# EAGLE design idecf (EAGLE 7.7.0)
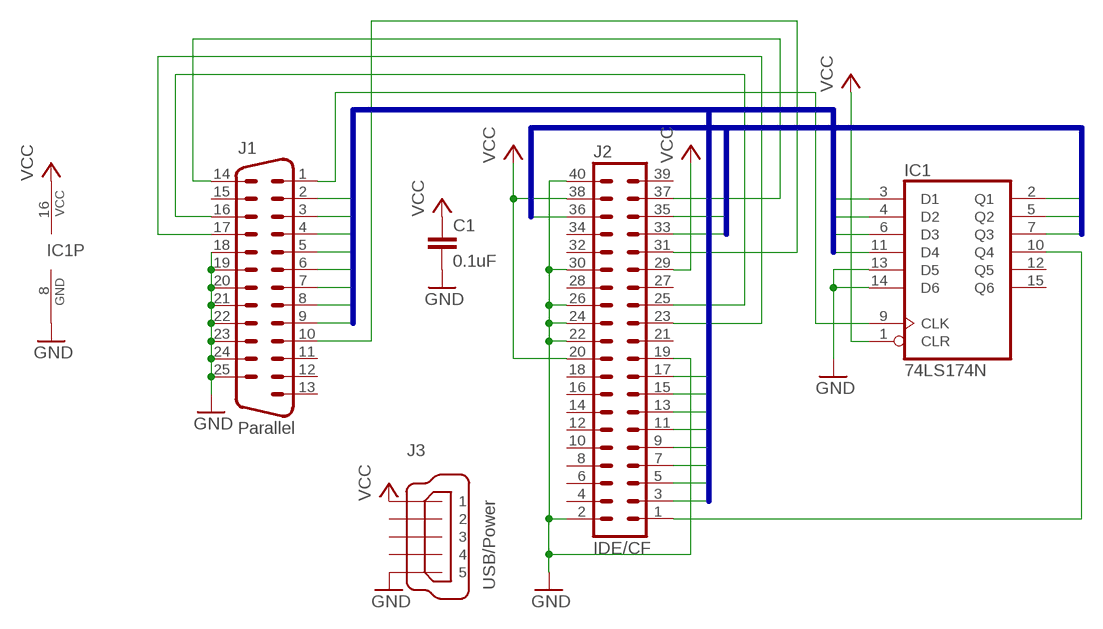
[diagram p0: schematic, sheet 1]

## Parts
C1  0.1uF  C-EU050-024X044  [C050-024X044]
IC1  74LS174N  [DIL16]
J1  Parallel  M25HP  [M25HP]
J2  IDE/CF  MA20-2W  [MA20-2W]
J3  USB/Power  MINI-USB-32005-201  [32005-201]

## Nets
!CS0: J1.14 J2.37
!RD: J1.16 J2.25
!RESET: IC1.10(Q4) J2.1
!WR: J1.17 J2.23
A0: IC1.2(Q1) J2.35
A1: IC1.5(Q2) J2.33
A2: IC1.7(Q3) J2.36
ALE: IC1.9(CLK) J1.1
D0: IC1.3(D1) J1.2 J2.17
D1: IC1.4(D2) J1.3 J2.15
D2: IC1.6(D3) J1.4 J2.13
D3: IC1.11(D4) J1.5 J2.11
D4: J1.6 J2.9
D5: J1.7 J2.7
D6: J1.8 J2.5
D7: J1.9 J2.3
GND: C1.2 IC1.8(GND) IC1.13(D5) IC1.14(D6) J1.18 J1.19 J1.20 J1.21 J1.22 J1.23 J1.24 J1.25 J2.2 J2.19 J2.22 J2.24 J2.26 J2.30 J2.40 J3.5
IRQ: J1.10 J2.31
VCC: C1.1 IC1.1(CLR) IC1.16(VCC) J2.20 J2.29 J2.38 J3.1
Unconnected: IC1.12(Q5) IC1.15(Q6) J1.11 J1.12 J1.13 J1.15 J2.4 J2.6 J2.8 J2.10 J2.12 J2.14 J2.16 J2.18 J2.21 J2.27 J2.28 J2.32 J2.34 J2.39 J3.2 J3.3 J3.4

## Buses
D[0..7]
A[0..2]

## Library data of the parts
C1 = rcl:C-EU: CAPACITOR, European symbol
IC1 = 74xx-us:74*174: Hex D type FLIP FLOP, clear
J1 = con-subd:M25: SUB-D; OC_FARNELL: unknown; OC_NEWARK: unknown
J2 = con-lstb:MA20-2W: PIN HEADER; OC_FARNELL: unknown; OC_NEWARK: unknown
J3 = con-cypressindustries:MINI-USB-: MINI USB-B Conector Source: www.cypressindustries.com; OC_FARNELL: unknown; OC_NEWARK: unknown

## Board
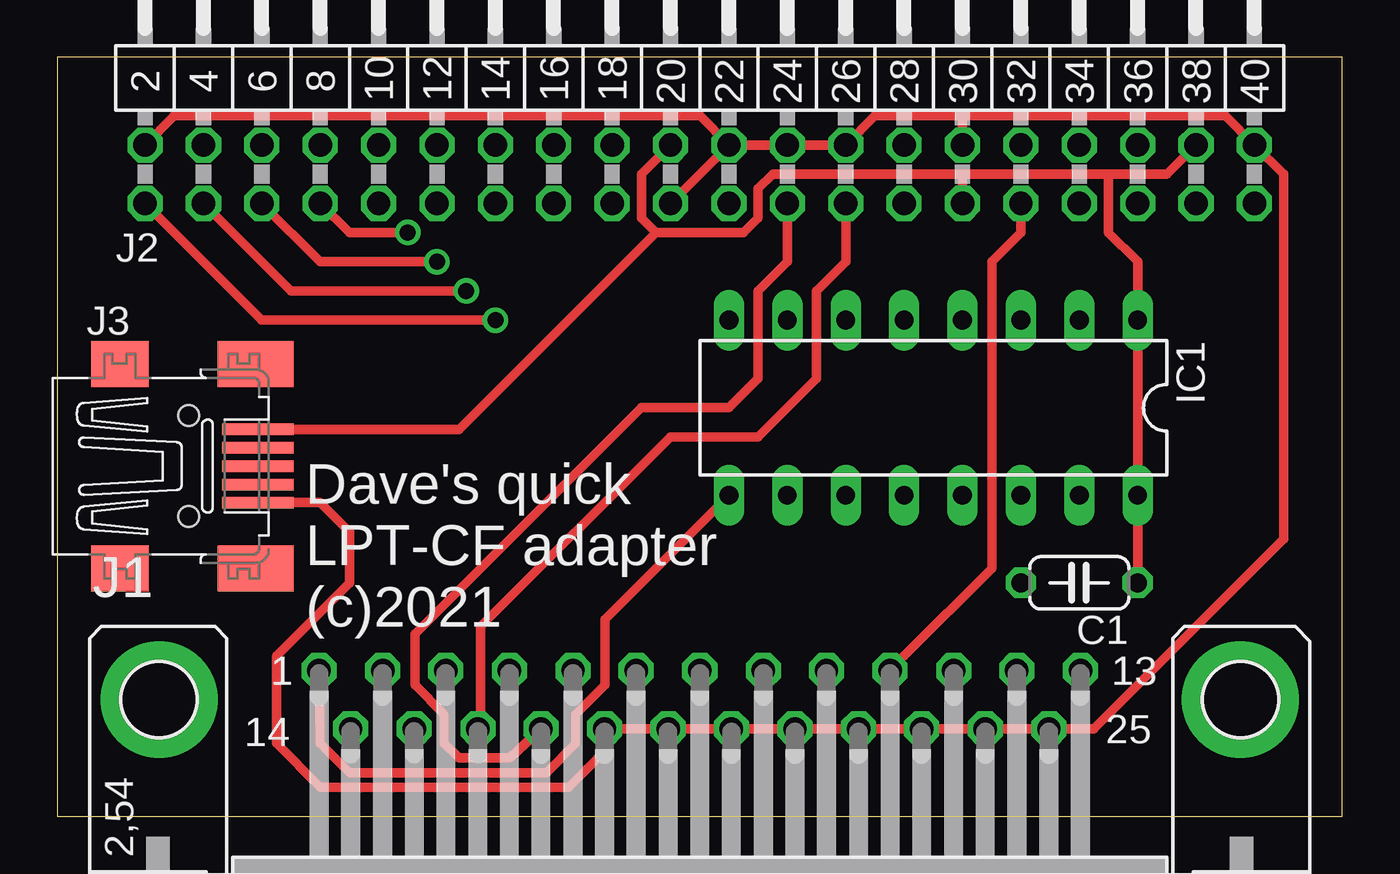
[diagram p1: board, top side]
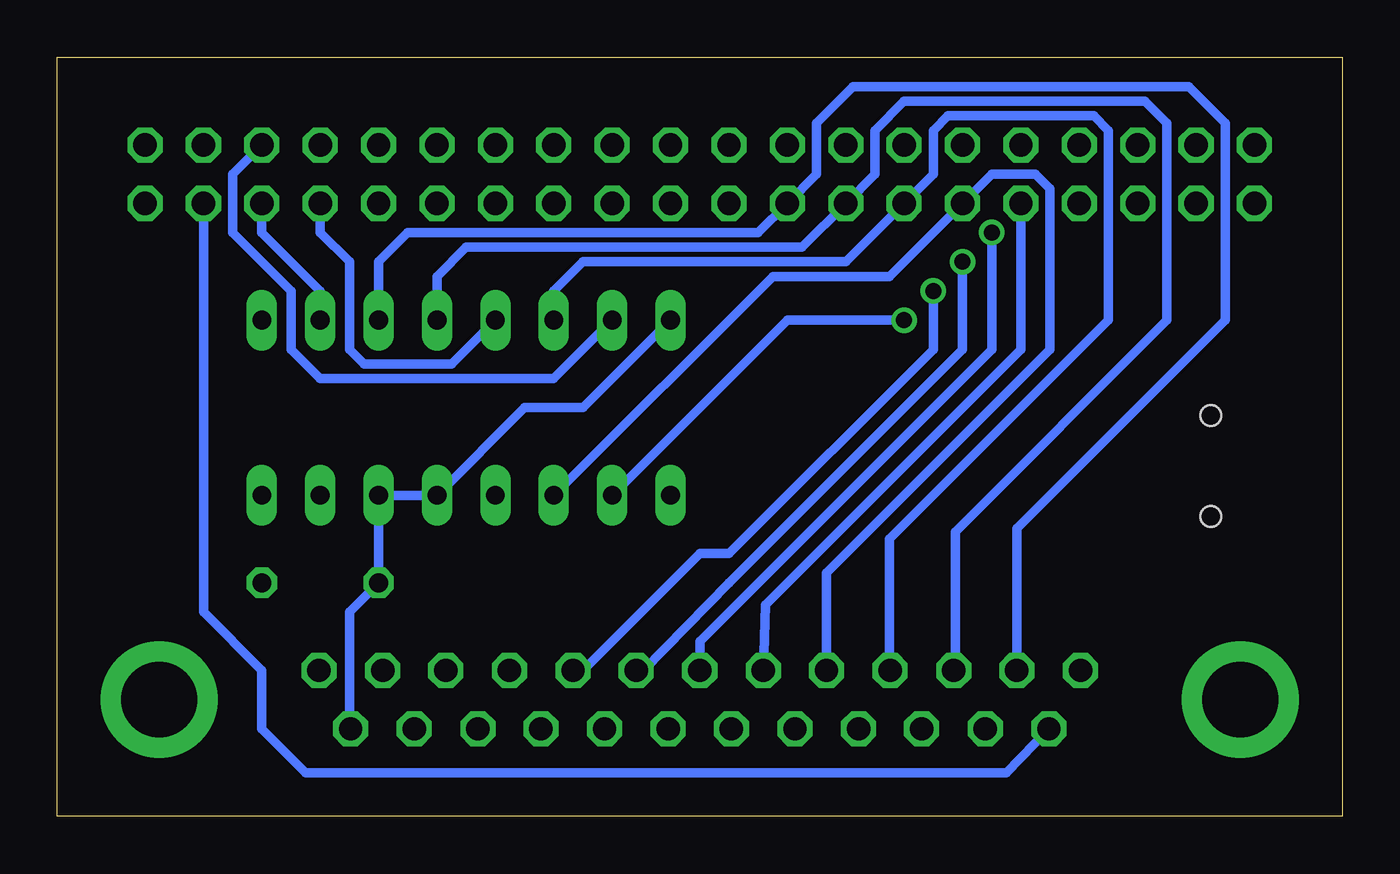
[diagram p2: board, bottom side, seen from below]

Size 55.88 x 33.02 mm. Coordinates in mm from the lower left corner, seen from the top.
Outline: 0,0 55.88,0 55.88,33.02 0,33.02 0,0
Copper layers (1*16): Top 0.035mm / dielectric 1.5mm / Bottom 0.035mm
Design rules "default": minimum track width 10mil, minimum drill 24mil, track to track 8mil, track to pad 8mil, pad to pad 8mil, via to via 8mil, smd to smd 8mil, copper to edge 40mil, drill to drill 8mil, minimum pad ring 10mil, minimum via ring 8mil, stop-mask expansion 4mil, vias tented up to drill 0mil, thermal gap 10mil

### Footprints (pad centres in the part's own frame; a part is rotated, then mirrored left to right if it is on the bottom)
C050-024X044 = drill 0.813 octagon: 1 -2.54,0; 2 2.54,0
DIL16 = drill 0.813 long: 1 -8.89,-3.81; 2 -6.35,-3.81; 3 -3.81,-3.81; 4 -1.27,-3.81; 5 1.27,-3.81; 6 3.81,-3.81; 7 6.35,-3.81; 8 8.89,-3.81; 9 8.89,3.81; 10 6.35,3.81; 11 3.81,3.81; 12 1.27,3.81; 13 -1.27,3.81; 14 -3.81,3.81; 15 -6.35,3.81; 16 -8.89,3.81
M25HP = drill 1.016 octagon: 1 -16.561,1.27; 2 -13.792,1.27; 3 -11.049,1.27; 4 -8.28,1.27; 5 -5.512,1.27; 6 -2.769,1.27; 7 0,1.27; 8 2.769,1.27; 9 5.512,1.27; 10 8.28,1.27; 11 11.049,1.27; 12 13.792,1.27; 13 16.561,1.27; 14 -15.189,-1.27; 15 -12.421,-1.27; 16 -9.652,-1.27; 17 -6.909,-1.27; 18 -4.14,-1.27; 19 -1.372,-1.27; 20 1.372,-1.27; 21 4.14,-1.27; 22 6.909,-1.27; 23 9.652,-1.27; 24 12.421,-1.27; 25 15.189,-1.27 | drill 3.302 pad 5.08: G1 -23.52,0; G2 23.52,0
MA20-2W = drill 1.016 octagon: 1 -24.13,-1.27; 2 -24.13,1.27; 3 -21.59,-1.27; 4 -21.59,1.27; 5 -19.05,-1.27; 6 -19.05,1.27; 7 -16.51,-1.27; 8 -16.51,1.27; 9 -13.97,-1.27; 10 -13.97,1.27; 11 -11.43,-1.27; 12 -11.43,1.27; 13 -8.89,-1.27; 14 -8.89,1.27; 15 -6.35,-1.27; 16 -6.35,1.27; 17 -3.81,-1.27; 18 -3.81,1.27; 19 -1.27,-1.27; 20 -1.27,1.27; 21 1.27,-1.27; 22 1.27,1.27; 23 3.81,-1.27; 24 3.81,1.27; 25 6.35,-1.27; 26 6.35,1.27; 27 8.89,-1.27; 28 8.89,1.27; 29 11.43,-1.27; 30 11.43,1.27; 31 13.97,-1.27; 32 13.97,1.27; 33 16.51,-1.27; 34 16.51,1.27; 35 19.05,-1.27; 36 19.05,1.27; 37 21.59,-1.27; 38 21.59,1.27; 39 24.13,-1.27; 40 24.13,1.27
32005-201 = smd 3.1 x 0.5: 1 3,1.6; 2 3,0.8; 3 3,0; 4 3,-0.8; 5 3,-1.6 | smd 2.5 x 2: M1 -3,-4.45; M2 -3,4.45 | smd 3.3 x 2: M3 2.9,4.45; M4 2.9,-4.45 | hole 0.9: 0,2.2; 0,-2.2

### Placement (x,y rotation side)
C1  44.45,10.16 180 top
IC1  38.1,17.78 180 top
J1  27.94,5.08 0 top
J2  27.94,27.94 0 top
J3  5.71,15.24 0 top

### Tracks (layer width: path | path; a pad name or v marks a point on that pad's centre or on a via)
!CS0
  Bottom 0.406: J2.37 49.53,8.89 46.99,6.35 46.99,3.81 45.09,1.91 14.61,1.91 J1.14
!RD
  Top 0.406: J2.25 34.29,24.13 33.02,22.86 33.02,19.05 30.48,16.51 26.67,16.51 18.41,8.26 18.41,4.13 J1.16
!RESET  (via drill 0.7)
  Top 0.406: J2.1 8.89,21.59 v19.05,21.59
  Bottom 0.406: v19.05,21.59 24.13,21.59 IC1.10
!WR
  Top 0.406: J1.17 19.68,2.54 17.46,2.54 16.83,3.17 16.83,4.45 15.56,5.71 15.56,7.94 25.4,17.78 29.21,17.78 30.48,19.05 30.48,22.86 31.75,24.13 J2.23
A0
  Bottom 0.406: IC1.2 44.45,22.86 46.99,25.4 J2.35
A1
  Bottom 0.406: IC1.5 38.73,19.68 42.55,19.68 43.18,20.32 43.18,24.13 44.45,25.4 J2.33
A2
  Bottom 0.406: IC1.7 34.29,19.05 44.45,19.05 45.72,20.32 45.72,22.86 48.26,25.4 48.26,27.94 J2.36
ALE
  Top 0.406: J1.1 11.43,3.17 12.7,1.91 21.27,1.91 22.54,3.17 22.54,4.45 23.81,5.71 23.81,8.57 IC1.9
D0
  Bottom 0.406: J1.2 14.15,12.52 5.08,21.59 5.08,30.16 6.67,31.75 21.27,31.75 22.86,30.16 22.86,27.94 J2.17 25.4,25.4 40.64,25.4 41.91,24.13 IC1.3
D1
  Bottom 0.406: J1.3 16.83,6.41 16.83,12.38 7.62,21.59 7.62,30.16 8.57,31.11 19.05,31.11 20.32,29.84 20.32,27.94 J2.15 23.5,24.77 38.1,24.77 39.37,23.5 IC1.4
D2
  Bottom 0.406: J1.4 19.68,6.38 19.68,12.06 10.16,21.59 10.16,29.84 10.79,30.48 17.14,30.48 17.78,29.84 17.78,27.94 J2.13 21.59,24.13 33.02,24.13 34.29,22.86 IC1.6
D3
  Bottom 0.406: J1.5 22.43,10.59 12.7,20.32 12.7,27.3 13.34,27.94 15.24,27.94 J2.11 19.68,23.5 24.77,23.5 IC1.11
D4
  Bottom 0.406: J2.9 13.97,20.32 25.08,9.21 J1.6
D5  (via drill 0.7)
  Top 0.406: J2.7 12.7,25.4 v15.24,25.4
  Bottom 0.406: v15.24,25.4 15.24,20.32 27.94,7.62 J1.7
D6  (via drill 0.7)
  Top 0.406: J2.5 11.43,24.13 v16.51,24.13
  Bottom 0.406: v16.51,24.13 16.51,20.32 26.67,10.16 30.39,6.35 J1.8
D7  (via drill 0.7)
  Top 0.406: J2.3 10.16,22.86 v17.78,22.86
  Bottom 0.406: v17.78,22.86 17.78,20.32 26.67,11.43 27.94,11.43 33.02,6.35 J1.9
GND
  Top 0.406: 39.37,30.48 50.8,30.48 J2.40 53.34,27.94 53.34,12.06 45.09,3.81 J1.25 J1.24 J1.23 J1.22 J1.21 J1.20 J1.19 J1.18 23.8,3.8 23.81,2.86 22.23,1.27 11.43,1.27 9.53,3.17 9.53,6.99 12.7,10.16 12.7,12.38 11.43,13.65 9.68,13.65 J3.5 | 39.37,30.48 35.56,30.48 J2.26 J2.24 J2.22 | J2.22 27.94,30.48 5.08,30.48 J2.2 | J2.30 39.37,30.48 | J2.19 J2.22
  Bottom 0.406: IC1.8 33.02,17.78 35.56,17.78 IC1.13 IC1.14 C1.2 43.18,8.89 43.18,3.86 J1.25
IRQ
  Top 0.406: J2.31 41.91,25.4 40.64,24.13 40.64,10.79 36.83,6.99 J1.10
VCC
  Top 0.406: C1.1 IC1.16 IC1.1 46.99,24.13 45.72,25.4 45.72,27.94 | 45.72,27.94 39.37,27.94 | 39.37,27.94 J2.29 | J3.1 11.11,16.83 17.46,16.83 26.04,25.4 | 39.37,27.94 31.11,27.94 30.48,27.3 30.48,26.04 29.84,25.4 26.04,25.4 | J2.38 48.26,27.94 45.72,27.94 | J2.20 25.4,27.94 25.4,26.04 26.04,25.4

### Text on the board
tNames: Dave's quick / LPT-CF adapter / (c)2021